# EAGLE design clock (EAGLE 9.6.2)
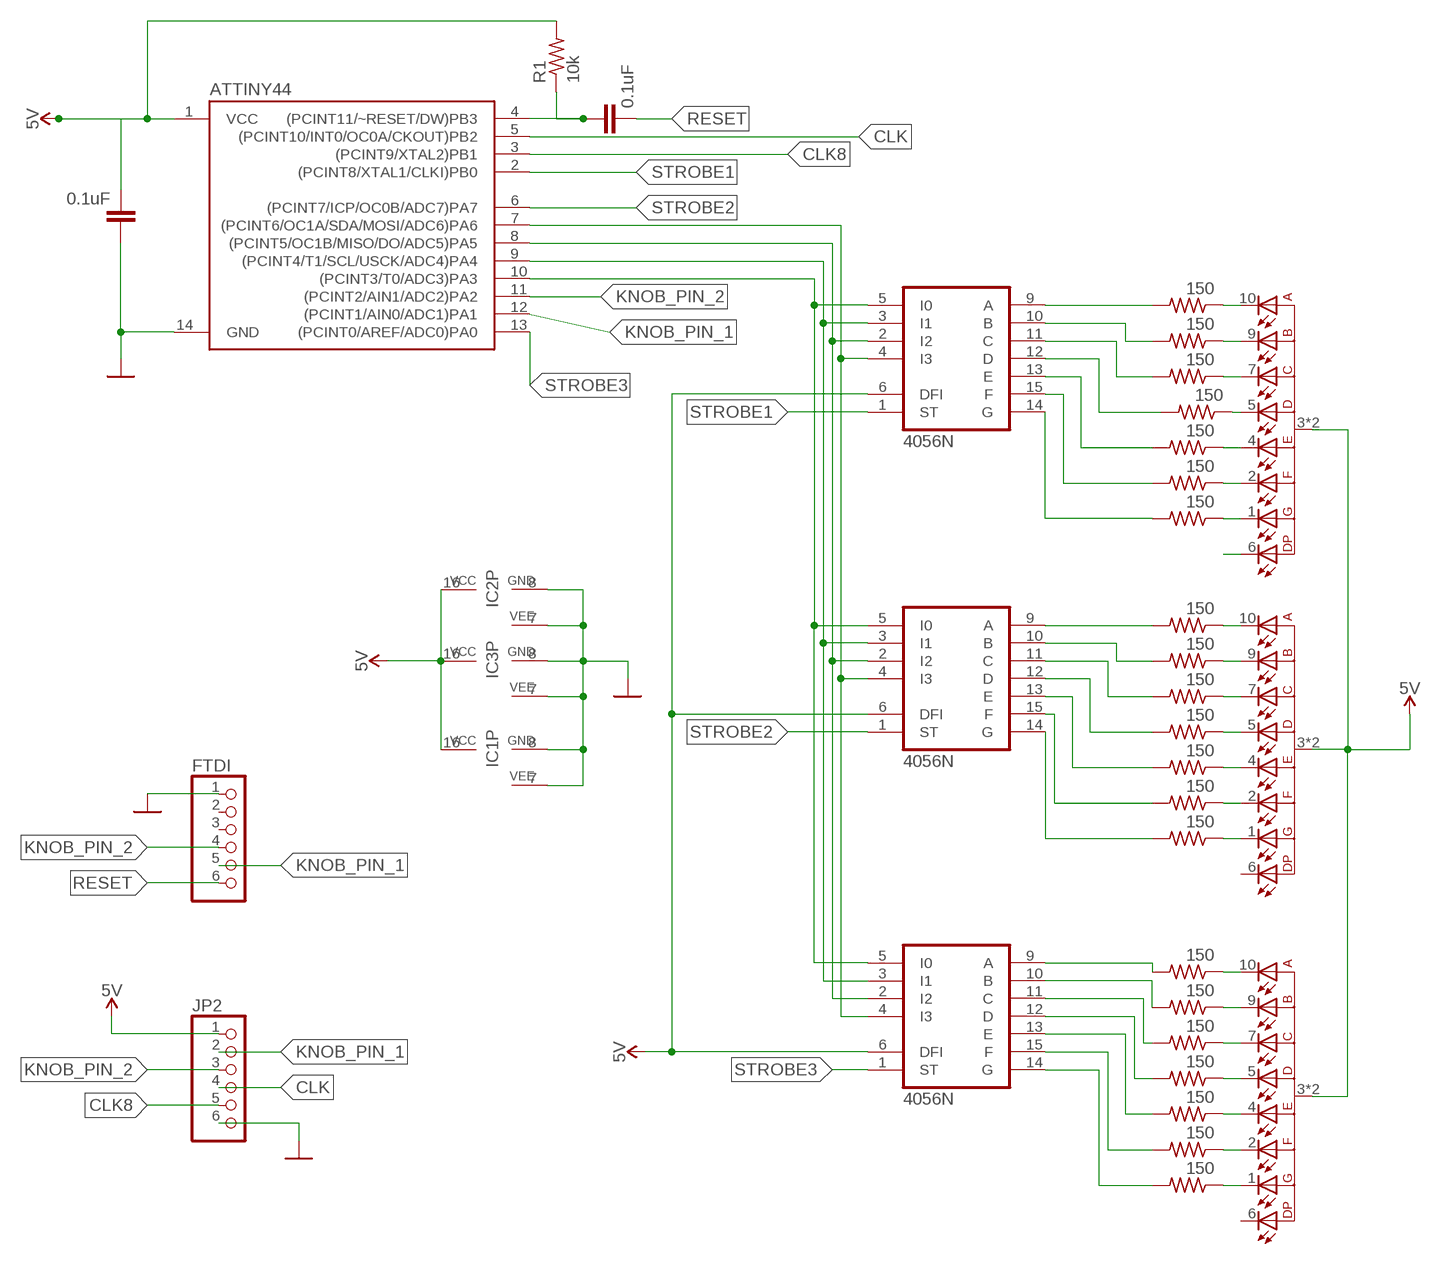
[diagram p0: schematic, sheet 1]

## Parts
ATTINY44  ATTINY84ATTINY84-20PU  [DIP14]
C2  0.1uF  0.1UF-KIT-EZ-50V-20%  [CAP-PTH-SMALL-KIT]
C3  0.1uF  0.1UF-KIT-EZ-50V-20%  [CAP-PTH-SMALL-KIT]
D1  157119S12801  WL-T7DS_0.39INCH_COMMON-ANODE_157119S12801  [WL-T7DS_0.39INCH]
D2  157119S12801  WL-T7DS_0.39INCH_COMMON-ANODE_157119S12801  [WL-T7DS_0.39INCH]
D3  157119S12801  WL-T7DS_0.39INCH_COMMON-ANODE_157119S12801  [WL-T7DS_0.39INCH]
FTDI  PINHD-1X6  [1X06]
IC1  4056N  [DIL16]
IC2  4056N  [DIL16]
IC3  4056N  [DIL16]
JP2  PINHD-1X6  [1X06]
R1  10k  R-US_0207/12  [0207/12]
R2  150  R-US_0207/12  [0207/12]
R3  150  R-US_0207/12  [0207/12]
R4  150  R-US_0207/12  [0207/12]
R5  150  R-US_0207/12  [0207/12]
R6  150  R-US_0207/12  [0207/12]
R7  150  R-US_0207/12  [0207/12]
R8  150  R-US_0207/12  [0207/12]
R10  150  R-US_0207/12  [0207/12]
R11  150  R-US_0207/12  [0207/12]
R12  150  R-US_0207/12  [0207/12]
R13  150  R-US_0207/12  [0207/12]
R14  150  R-US_0207/12  [0207/12]
R15  150  R-US_0207/12  [0207/12]
R16  150  R-US_0207/12  [0207/12]
R18  150  R-US_0207/12  [0207/12]
R19  150  R-US_0207/12  [0207/12]
R20  150  R-US_0207/12  [0207/12]
R21  150  R-US_0207/12  [0207/12]
R22  150  R-US_0207/12  [0207/12]
R23  150  R-US_0207/12  [0207/12]
R24  150  R-US_0207/12  [0207/12]

## Nets
5V: ATTINY44.1(VCC) C3.2 D1.3(+) D1.8(+) D2.3(+) D2.8(+) D3.3(+) D3.8(+) IC1.6(DFI) IC1.16(VCC) IC2.6(DFI) IC2.16(VCC) IC3.6(DFI) IC3.16(VCC) JP2.1 R1.2
CLK: ATTINY44.5((PCINT10/INT0/OC0A/CKOUT)PB2) JP2.4
CLK8: ATTINY44.3((PCINT9/XTAL2)PB1) JP2.5
GND: ATTINY44.14(GND) C3.1 FTDI.1 IC1.7(VEE) IC1.8(GND) IC2.7(VEE) IC2.8(GND) IC3.7(VEE) IC3.8(GND) JP2.6
KNOB_PIN_1: ATTINY44.12((PCINT1/AIN0/ADC1)PA1) FTDI.5 JP2.2
KNOB_PIN_2: ATTINY44.11((PCINT2/AIN1/ADC2)PA2) FTDI.4 JP2.3
N$1: IC1.9(A) R18.2
N$2: ATTINY44.4((PCINT11/~RESET/DW)PB3) C2.1 R1.1
N$3: ATTINY44.10((PCINT3/T0/ADC3)PA3) IC1.5(I0) IC2.5(I0) IC3.5(I0)
N$4: IC1.10(B) R19.2
N$5: ATTINY44.9((PCINT4/T1/SCL/USCK/ADC4)PA4) IC1.3(I1) IC2.3(I1) IC3.3(I1)
N$6: ATTINY44.8((PCINT5/OC1B/MISO/DO/ADC5)PA5) IC1.2(I2) IC2.2(I2) IC3.2(I2)
N$7: ATTINY44.7((PCINT6/OC1A/SDA/MOSI/ADC6)PA6) IC1.4(I3) IC2.4(I3) IC3.4(I3)
N$8: IC1.11(C) R20.2
N$9: IC1.12(D) R21.2
N$10: IC1.13(E) R22.2
N$11: IC1.15(F) R23.2
N$12: IC1.14(G) R24.2
N$13: IC3.14(G) R16.2
N$14: IC3.15(F) R15.2
N$15: IC3.13(E) R14.2
N$16: IC3.12(D) R13.2
N$17: IC3.11(C) R12.2
N$18: IC3.10(B) R11.2
N$19: IC3.9(A) R10.2
N$20: IC2.14(G) R8.2
N$21: IC2.15(F) R7.2
N$22: IC2.13(E) R6.2
N$23: IC2.12(D) R5.2
N$24: IC2.11(C) R4.2
N$25: IC2.10(B) R3.2
N$26: IC2.9(A) R2.2
N$27: D1.10 R2.1
N$28: D1.9 R3.1
N$29: D1.7 R4.1
N$30: D1.5 R5.1
N$31: D1.4 R6.1
N$32: D1.2 R7.1
N$33: D1.1 R8.1
N$34: D1.6
N$35: D3.10 R10.1
N$36: D3.9 R11.1
N$37: D3.7 R12.1
N$38: D3.5 R13.1
N$39: D3.4 R14.1
N$40: D3.2 R15.1
N$41: D3.1 R16.1
N$42: D2.10 R18.1
N$43: D2.9 R19.1
N$44: D2.7 R20.1
N$45: D2.5 R21.1
N$46: D2.4 R22.1
N$47: D2.2 R23.1
N$48: D2.1 R24.1
RESET: C2.2 FTDI.6
STROBE1: ATTINY44.2((PCINT8/XTAL1/CLKI)PB0) IC2.1(ST)
STROBE2: ATTINY44.6((PCINT7/ICP/OC0B/ADC7)PA7) IC3.1(ST)
STROBE3: ATTINY44.13((PCINT0/AREF/ADC0)PA0) IC1.1(ST)
Unconnected: D2.6 D3.6 FTDI.2 FTDI.3

## Library data of the parts
ATTINY44 = SparkFun-IC-Microcontroller:ATTINY84: Atmel 14-pin 2/4/8kB flash uC Datasheet <https://cdn.sparkfun.com/datasheets/Widgets/doc8006.pdf> SparkFun Products Tiny AVR Programmer <https://www.sparkfun.com/products/11801> (PGM-11801) SparkFun Servo Trigger - Continuous Rotation <https://www.sparkfun.com/products/13872> (WIG-13872) SparkFun Servo Trigger <https://www.sparkfun.com/products/13118> (WIG-13118)
C2 C3 = SparkFun-Capacitors:0.1UF: 0.1µF ceramic capacitors A capacitor is a passive two-terminal electrical component used to store electrical energy temporarily in an electric field.; PROD_ID: CAP-08370
D1-D3 = Wurth_7 Segments Display_WL-T7DS:WL-T7DS_0.39INCH_COMMON-ANODE: WL-T7DS 7 Segments Display THT Single Digit Characteristics Industrial standard size and schematic Low power consumption Grey surface Milky / Diffuesed segments Driving with DC current in forward direction only Suitable for high peak current upto 100 mA Applications Audio / measure equipment Instrument panels Digital read out display Control units <https://www.we-online.com/catalog/media/o447285v209%20WL_T7DS_Group.jpg> Details see: https://www.we-online.com/catalog/en/WL-T7DS Created by Ella Wu, 2021-05-31 2021 (C) Wurth Elektronik; DATASHEET-URL: https://www.we-online.com/catalog/datasheet/157119S12801.pdf; EMITTING-COLOR: Super Red; HEIGHT: 7mm; IV-TYP: 38mcd; LENGTH: 13mm; PART-NUMBER: 157119S12801; VF-TYP: 2V; WIDTH: 10mm
FTDI JP2 = pinhead:PINHD-1X6: PIN HEADER
IC1-IC3 = 40xx:4056: BCD to 7-segment LCD DECODER/DRIVER
R1-R8 R10-R16 R18-R24 = adafruit:R-US_: RESISTOR, American symbol

## Board
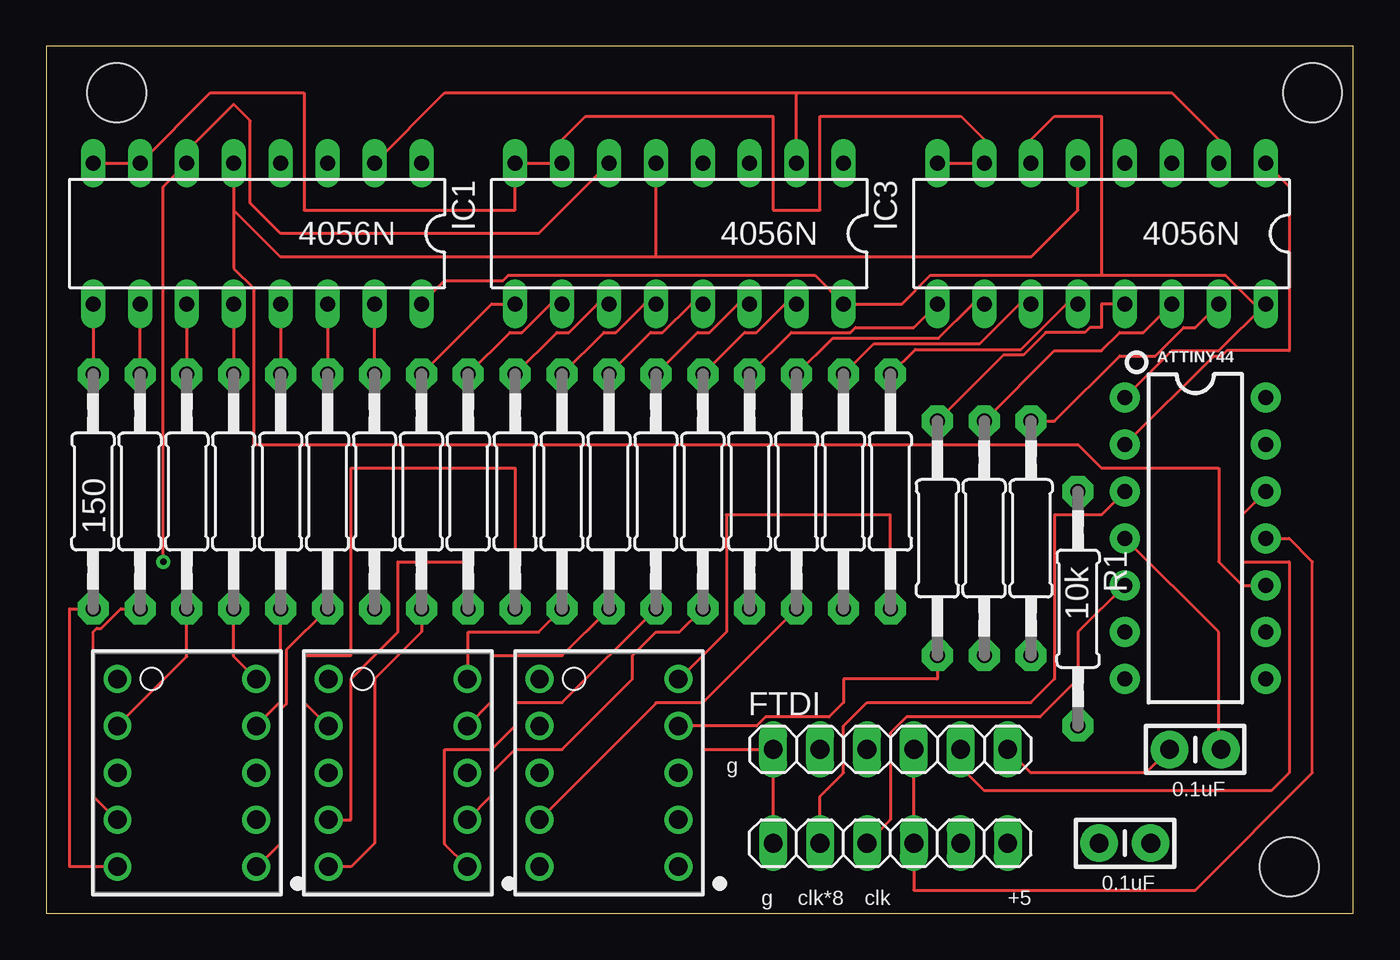
[diagram p1: board, top side]
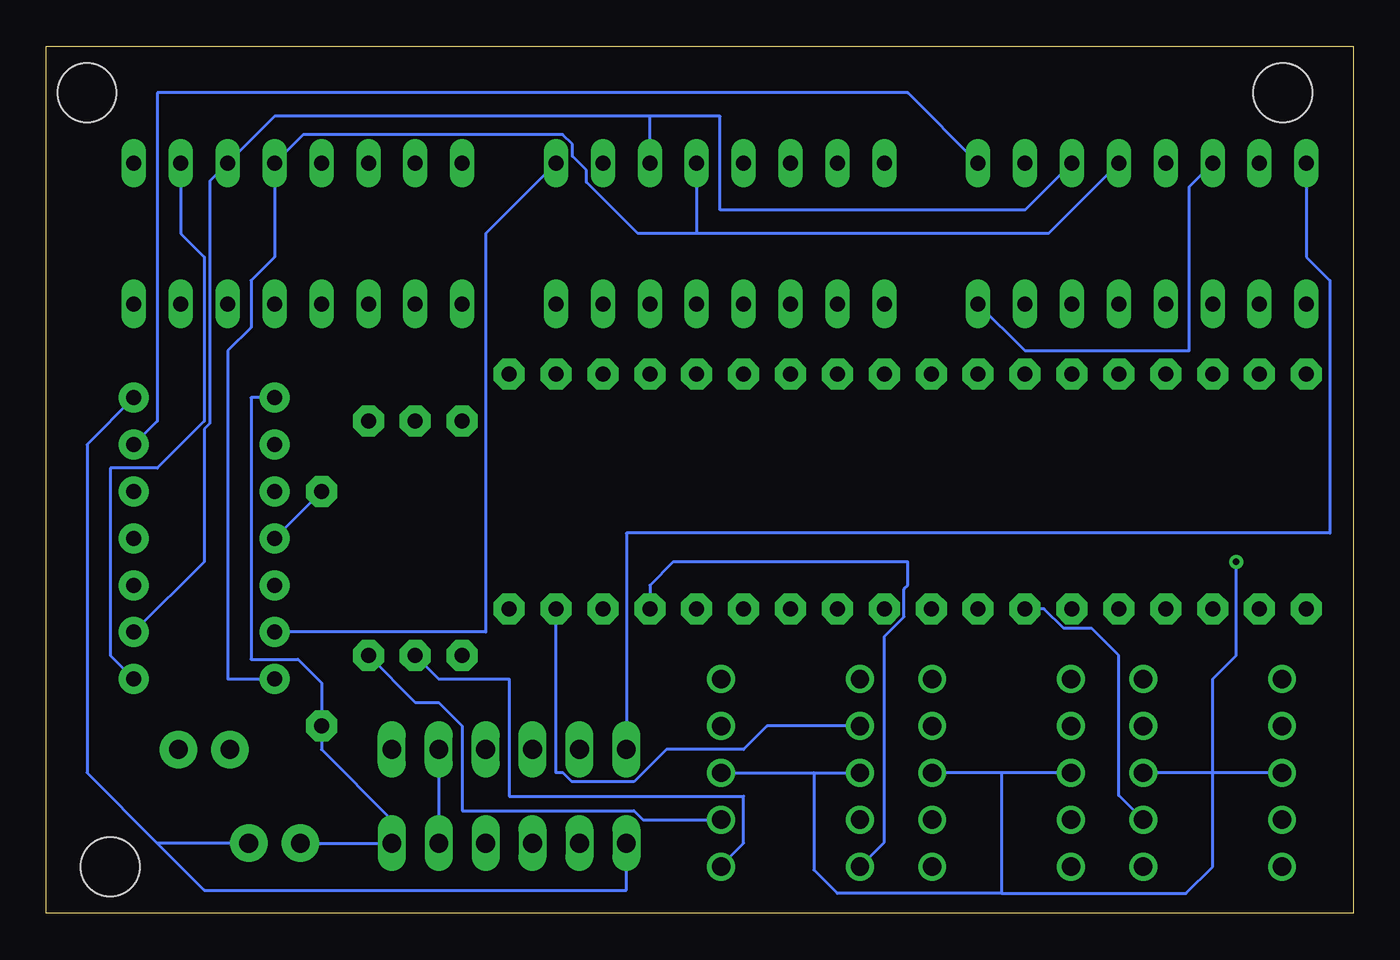
[diagram p2: board, bottom side, seen from below]

Size 70.79 x 46.98 mm. Coordinates in mm from the lower left corner, seen from the top.
Outline: 0,0 70.79,0 70.79,46.98 0,46.98 0,0
Copper layers (1*16): Top 0.035mm / dielectric 1.5mm / Bottom 0.035mm
Design rules "default": minimum track width 6mil, minimum drill 0.35mm, track to track 6mil, track to pad 6mil, pad to pad 6mil, via to via 6mil, smd to smd 6mil, copper to edge 40mil, drill to drill 6mil, minimum pad ring 10mil, minimum via ring 8mil, stop-mask expansion 4mil, vias tented up to drill 0mil, thermal gap 10mil
Holes 3.2 mm at 3.81,44.45 68.58,44.45 67.31,2.54

### Footprints (pad centres in the part's own frame; a part is rotated, then mirrored left to right if it is on the bottom)
DIP14 = drill 0.813 pad 1.626: 1 -7.62,-3.81; 2 -5.08,-3.81; 3 -2.54,-3.81; 4 0,-3.81; 5 2.54,-3.81; 6 5.08,-3.81; 7 7.62,-3.81; 8 7.62,3.81; 9 5.08,3.81; 10 2.54,3.81; 11 0,3.81; 12 -2.54,3.81; 13 -5.08,3.81; 14 -7.62,3.81
CAP-PTH-SMALL-KIT = drill 1.016 pad 2.032: 1 -1.397,0; 2 1.397,0
WL-T7DS_0.39INCH = drill 1: 1 -3.76,5.08; 2 -3.76,2.54; 3 -3.76,0; 4 -3.76,-2.54; 5 -3.76,-5.08; 6 3.76,-5.08; 7 3.76,-2.54; 8 3.76,0; 9 3.76,2.54; 10 3.76,5.08
1X06 = drill 1.016 long: 1 -6.35,0; 2 -3.81,0; 3 -1.27,0; 4 1.27,0; 5 3.81,0; 6 6.35,0
DIL16 = drill 0.813 long: 1 -8.89,-3.81; 2 -6.35,-3.81; 3 -3.81,-3.81; 4 -1.27,-3.81; 5 1.27,-3.81; 6 3.81,-3.81; 7 6.35,-3.81; 8 8.89,-3.81; 9 8.89,3.81; 10 6.35,3.81; 11 3.81,3.81; 12 1.27,3.81; 13 -1.27,3.81; 14 -3.81,3.81; 15 -6.35,3.81; 16 -8.89,3.81
0207/12 = drill 0.813 pad 1.676 octagon: 1 -6.35,0; 2 6.35,0

### Placement (x,y rotation side)
ATTINY44  62.23,20.32 270 top
C2  62.23,8.89 180 top
C3  58.42,3.81 180 top
D1  30.48,7.62 180 top
D2  7.62,7.62 180 top
D3  19.05,7.62 180 top
FTDI  45.72,8.89 0 top
IC1  11.43,36.83 180 top
IC2  57.15,36.83 180 top
IC3  34.29,36.83 180 top
JP2  45.72,3.81 180 top
R1  55.88,16.51 270 top
R2  38.1,22.86 90 top
R3  40.64,22.86 90 top
R4  43.18,22.86 90 top
R5  45.72,22.86 90 top
R6  48.26,20.32 90 top
R7  53.34,20.32 90 top
R8  50.8,20.32 90 top
R10  20.32,22.86 90 top
R11  22.86,22.86 90 top
R12  25.4,22.86 90 top
R13  27.94,22.86 90 top
R14  30.48,22.86 90 top
R15  35.56,22.86 90 top
R16  33.02,22.86 90 top
R18  2.54,22.86 90 top
R19  5.08,22.86 90 top
R20  7.62,22.86 90 top
R21  10.16,22.86 90 top
R22  12.7,22.86 90 top
R23  17.78,22.86 90 top
R24  15.24,22.86 90 top

### Tracks (layer width: path | path; a pad name or v marks a point on that pad's centre or on a via)
5V  (via drill 0.35)
  Top 0.152: ATTINY44.1 60.96,30.48 63.5,30.48 IC2.16 65.42,33.02 63.87,34.57 57.15,34.57 | IC1.16 21.59,34.29 24.75,34.29 25.03,34.57 41.63,34.57 IC3.16 46.34,33.02 47.89,34.57 57.15,34.57 | IC2.6 53.34,41.91 54.61,43.18 57.15,43.18 57.15,34.57 | IC3.6 26.67,36.83 12.7,36.83 11.05,38.48 11.05,42.94 10.16,43.83 7.62,41.29 IC1.6 6.35,39.37 v6.35,19.05
  Bottom 0.152: ATTINY44.1 59.69,27.94 59.69,13.77 57.15,13.77 55.88,12.5 R1.2 55.88,8.89 52.07,5.08 JP2.1 C3.2 | IC1.16 17.78,30.48 8.89,30.48 8.89,39.37 IC1.6 | D1.3 29.21,7.62 | 29.21,7.62 D1.8 | 22.81,7.22 D3.3 19.05,7.62 | D2.8 7.62,7.62 | 7.62,7.62 D2.3 | D3.8 19.05,7.62 | 29.21,7.62 29.21,2.36 27.94,1.09 19.05,1.09 | 19.05,1.09 9.07,1.09 7.62,2.54 7.62,7.62 | 19.05,7.62 19.05,1.09 | 7.62,7.62 7.62,12.7 6.35,13.97 v6.35,19.05
CLK
  Top 0.152: JP2.4 45.72,5.08 45.72,9.78 46.58,10.64 53.82,10.64 55.88,12.7 55.88,15.24 ATTINY44.5
CLK8
  Top 0.152: ATTINY44.3 57.15,21.59 54.61,21.59 54.61,12.7 53.34,11.43 44.45,11.43 43.18,10.16 43.18,7.62 41.91,6.35 JP2.5
GND
  Top 0.152: IC1.8 IC1.7 8.89,44.45 13.97,44.45 13.97,38.1 25.4,38.1 IC3.8 IC3.7 27.94,41.91 29.21,43.18 39.37,43.18 39.37,38.1 41.91,38.1 41.91,43.18 49.53,43.18 50.8,41.91 IC2.7 IC2.8 | JP2.6 FTDI.1 35.51,8.89
  Bottom 0.152: FTDI.1 39.37,20.6 1.27,20.6 1.27,34.29 2.54,35.56 IC1.8 | JP2.6 39.37,1.27 62.23,1.27 64.77,3.81 | 64.77,3.81 68.58,7.62 68.58,25.4 ATTINY44.14 | C3.1 64.77,3.81
KNOB_PIN_1
  Top 0.152: ATTINY44.12 64.77,21.59 64.77,19.05 67.31,19.05 67.31,7.62 66.34,6.66 50.8,6.66 49.53,7.92 FTDI.5
  Bottom 0.152: FTDI.5 JP2.2
KNOB_PIN_2
  Top 0.152: ATTINY44.11 67.31,20.32 68.58,19.05 68.58,7.62 62.23,1.27 46.99,1.27 JP2.3 FTDI.4
N$1
  Top 0.152: IC1.9 R18.2
N$2
  Top 0.152: C2.1 63.5,9.02 63.5,15.24 ATTINY44.4
  Bottom 0.152: R1.1 ATTINY44.4
N$3
  Top 0.152: IC2.5 55.88,38.1 53.34,35.56 33.02,35.56 | 33.02,35.56 12.7,35.56 10.16,38.1 IC1.5 10.16,34.94 11.23,33.87 11.23,25.4 55.88,25.4 57.15,24.13 63.5,24.13 63.5,19.05 64.77,17.78 ATTINY44.10 66.04,17.98 | 33.02,35.56 IC3.5
N$4
  Top 0.152: R19.2 IC1.10
N$5
  Bottom 0.152: 38.1,43.18 58.42,43.18 IC2.3 61.92,39.67 61.92,26.54 62.23,26.24 62.23,19.05 ATTINY44.9 | IC3.3 38.1,43.18 | IC1.3 17.78,38.1 34.29,38.1 34.29,43.18 38.1,43.18
N$6
  Top 0.152: IC1.2 21.59,44.45 40.64,44.45 | 40.64,44.45 60.96,44.45 63.5,41.91 IC2.2 | IC3.2 40.64,44.45
  Bottom 0.152: IC2.2 63.5,36.83 62.23,35.56 62.23,26.67 64.77,24.13 67.31,24.13 67.31,13.97 ATTINY44.8
N$7
  Bottom 0.152: IC1.4 16.51,36.83 35.56,36.83 | IC3.4 35.56,36.83 | ATTINY44.7 60.96,12.7 60.96,30.48 59.69,31.75 59.69,34.29 58.42,35.56 IC2.4 56.87,42.19 42.81,42.19 42.29,41.67 42.29,41.02 41.53,40.26 41.53,39.61 38.75,36.83 35.56,36.83
N$8
  Top 0.152: IC1.11 R20.2
N$9
  Top 0.152: IC1.12 R21.2
N$10
  Top 0.152: IC1.13 R22.2
N$11
  Top 0.152: R23.2 IC1.15
N$12
  Top 0.152: IC1.14 R24.2
N$13
  Top 0.152: R16.2 35.28,31.47 35.93,31.47 37.48,33.02 IC3.14
N$14
  Top 0.152: R15.2 37.82,31.47 38.47,31.47 40.02,33.02 IC3.15
N$15
  Top 0.152: R14.2 32.74,31.47 33.39,31.47 34.94,33.02 IC3.13
N$16
  Top 0.152: R13.2 30.2,31.47 30.85,31.47 32.4,33.02 IC3.12
N$17
  Top 0.152: R12.2 27.66,31.47 28.31,31.47 29.86,33.02 IC3.11
N$18
  Top 0.152: R11.2 25.12,31.47 25.77,31.47 27.32,33.02 IC3.10
N$19
  Top 0.152: R10.2 24.13,33.02 IC3.9
N$20
  Top 0.152: R8.2 54.61,30.48 57.15,30.48 58.14,31.47 59.41,31.47 IC2.14
N$21
  Top 0.152: R7.2 54.61,26.67 58.14,30.2 60.06,30.2 61.61,31.75 62.23,31.75 IC2.15
N$22
  Top 0.152: IC2.13 57.15,33.02 57.15,31.75 56.53,31.75 56.25,31.47 54.14,31.47 52.92,30.25 51.84,30.25 R6.2
N$23
  Top 0.152: R5.2 47.07,30.56 52.79,30.56 55.26,33.02 IC2.12
N$24
  Top 0.152: R4.2 44.83,30.86 50.56,30.86 52.72,33.02 IC2.11
N$25
  Top 0.152: R3.2 42.6,31.17 48.32,31.17 50.18,33.02 IC2.10
N$26
  Top 0.152: R2.2 40.36,31.47 43.55,31.47 43.83,31.75 46.99,31.75 IC2.9
N$27
  Bottom 0.152: D1.10 25.4,3.86 25.4,15 24.33,16.07 24.33,17.58 24.13,17.78 24.13,19.05 36.83,19.05 38.1,17.78 R2.1
N$28
  Top 0.152: D1.9 33.02,11.38 33.02,11.43 35.56,11.43 R3.1
N$29
  Bottom 0.152: D1.7 31.75,10.16 33.02,8.89 37.21,8.89 38.96,7.14 42.32,7.14 42.8,7.62 43.18,7.62 R4.1
N$30
  Top 0.152: R5.1 45.72,21.59 36.83,21.59 36.83,15.24 34.29,12.7 D1.5
N$31
  Top 0.152: R6.1 48.26,12.7 43.18,12.7 43.18,11.43 42.39,10.64 38.96,10.64 38.48,10.16 D1.4
N$32
  Bottom 0.152: D1.2 38.48,5.08 38.96,5.56 48.26,5.56 48.26,10.16 49.53,11.43 50.8,11.43 R7.1
N$33
  Bottom 0.152: D1.1 34.24,2.59 33.02,3.81 33.02,6.35 45.72,6.35 45.72,12.7 49.53,12.7 R8.1
N$35
  Top 0.152: R10.1 20.32,15.24 17.78,12.7 17.78,3.81 16.51,2.54 D3.10
N$36
  Top 0.152: D3.9 16.51,5.08 16.51,12.7 19.05,15.24 19.05,19.05 22.86,19.05 R11.1
N$37
  Top 0.152: D3.7 15.24,10.16 13.97,11.43 13.97,13.97 16.51,13.97 16.51,24.13 25.4,24.13 R12.1
N$38
  Top 0.152: D3.5 22.86,12.75 22.86,15.24 26.67,15.24 R13.1
N$39
  Top 0.152: D3.4 24.13,11.48 24.13,13.97 27.94,13.97 R14.1
N$40
  Top 0.152: D3.2 24.13,6.4 24.13,7.62 25.4,8.89 27.94,8.89 31.75,12.7 31.75,13.97 33.02,15.24 34.29,15.24 R15.1
N$41
  Top 0.152: D3.1 21.59,3.76 21.59,8.89 24.13,8.89 25.4,10.16 25.4,11.43 27.94,11.43 R16.1
N$42
  Top 0.152: D2.10 1.27,2.54 1.27,16.51 R18.1
N$43
  Top 0.152: D2.9 3.81,5.08 2.54,6.35 2.54,15.24 2.74,15.44 2.98,15.44 4.05,16.51 R19.1
N$44
  Top 0.152: D2.7 7.62,13.92 R20.1
N$45
  Top 0.152: D2.5 10.16,13.92 R21.1
N$46
  Top 0.152: R22.1 12.7,11.48 D2.4
N$47
  Bottom 0.152: D2.2 12.7,6.4 12.7,13.97 14.17,15.44 15.68,15.44 16.75,16.51 R23.1
N$48
  Top 0.152: D2.1 11.43,2.54 12.7,3.81 12.7,11.05 13.01,11.35 13.01,14.28 R24.1
RESET
  Top 0.152: FTDI.6 53.34,7.62 59.56,7.62 C2.2
STROBE1
  Top 0.152: IC2.1 67.31,39.37 67.31,30.48 63.93,30.48 63.63,30.18 63.2,30.18 ATTINY44.2
STROBE2
  Bottom 0.152: IC3.1 46.99,36.83 46.99,15.24 ATTINY44.6
STROBE3
  Bottom 0.152: IC1.1 24.13,44.45 64.77,44.45 64.77,26.67 ATTINY44.13

### Text on the board
tPlace: g | 0.1uF | g | clk*8 | clk | +5 | 0.1uF